# Altium schematic sheet LVDT Driver.SchDoc
size A3
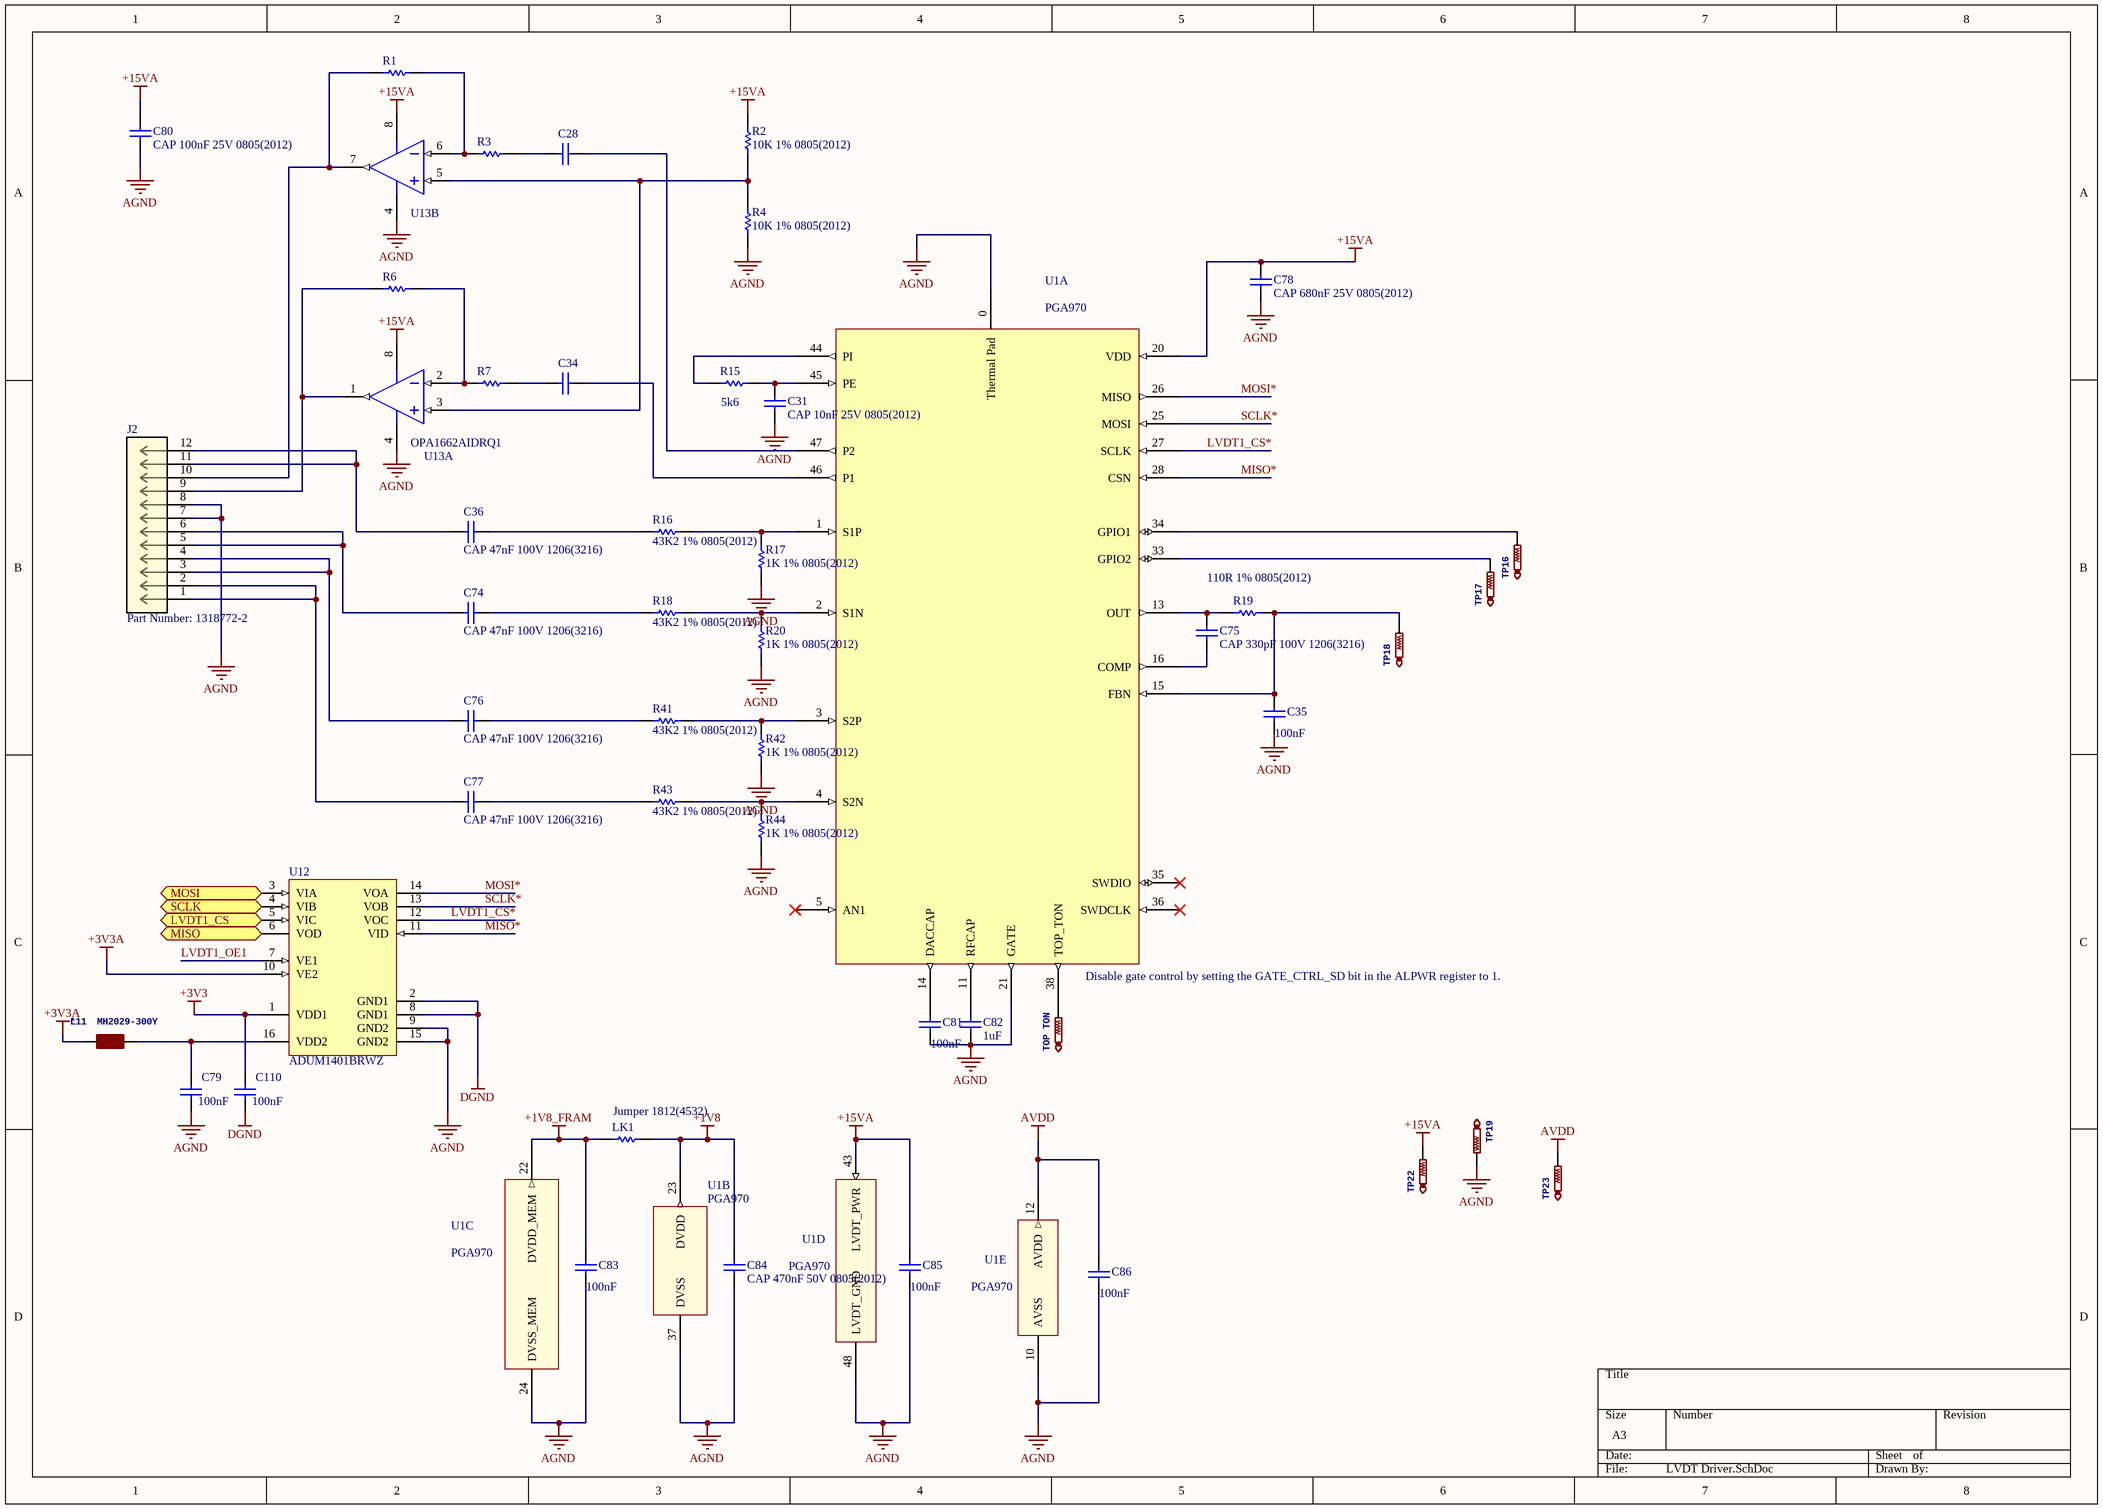
[diagram p0: LVDT Driver.SchDoc]

## Parts
C28  C1206C474K5RACTU  [CAPC3216X100X50LL20T25]  (value not drawn)
C31  CAP 10nF 25V 0805(2012)  [CAPC0805(2012)75_L]
C34  C1206C474K5RACTU  [CAPC3216X100X50LL20T25]  (value not drawn)
C35  100nF  [CAPC0805(2012)75_N]
C36  CAP 47nF 100V 1206(3216)  [CAPC1206(3216)100_L]
C74  CAP 47nF 100V 1206(3216)  [CAPC1206(3216)100_L]
C75  CAP 330pF 100V 1206(3216)  [CAPC1206(3216)170_L]
C76  CAP 47nF 100V 1206(3216)  [CAPC1206(3216)100_L]
C77  CAP 47nF 100V 1206(3216)  [CAPC1206(3216)100_L]
C78  CAP 680nF 25V 0805(2012)  [CAPC0805(2012)100_N]
C79  value 100nF  [CAPC0603(1608)100_N]  (hidden comment: CAP 100nF 25V 0603(1608))
C80  CAP 100nF 25V 0805(2012)  [CAPC0805(2012)75_N]
C81  100nF  [CAPC0805(2012)75_N]
C82  value 1uF  [CAPC2220(5750)230_L]  (hidden comment: CAP 4.7uF 50V 2220(5750))
C83  100nF  [CAPC0805(2012)75_N]
C84  CAP 470nF 50V 0805(2012)  [CAPC0805(2012)145_M]
C85  100nF  [CAPC0805(2012)75_N]
C86  100nF  [CAPC0805(2012)75_N]
C110  value 100nF  [CAPC0603(1608)100_N]  (hidden comment: CAP 100nF 25V 0603(1608))
J2  Part Number: 1318772-2  [CONN12_1318772]
L11  MH2029-300Y  [0805]
LK1  Jumper 1812(4532)  [RESC1812(4532)_M]
R1  510K 1% 0805(2012)  [RESC0805(2012)_L]  (value not drawn)
R2  10K 1% 0805(2012)  [RESC0805(2012)_M]
R3  31K6 1% 0805(2012)  [RESC0805(2012)_N]  (value not drawn)
R4  10K 1% 0805(2012)  [RESC0805(2012)_M]
R6  510K 1% 0805(2012)  [RESC0805(2012)_L]  (value not drawn)
R7  31K6 1% 0805(2012)  [RESC0805(2012)_N]  (value not drawn)
R15  value 5k6  [RESC0805(2012)_L]  (hidden comment: 5K6 1% 0805(2012))
R16  43K2 1% 0805(2012)  [RESC0805(2012)_L]
R17  1K 1% 0805(2012)  [RESC0805(2012)_M]
R18  43K2 1% 0805(2012)  [RESC0805(2012)_L]
R19  110R 1% 0805(2012)  [RESC0805(2012)_L]
R20  1K 1% 0805(2012)  [RESC0805(2012)_M]
R41  43K2 1% 0805(2012)  [RESC0805(2012)_L]
R42  1K 1% 0805(2012)  [RESC0805(2012)_M]
R43  43K2 1% 0805(2012)  [RESC0805(2012)_L]
R44  1K 1% 0805(2012)  [RESC0805(2012)_M]
TOP_TON  PTR1PAD1-13  [P1-13]  (value not drawn)
TP16  PTR1PAD1-13  [P1-13]  (value not drawn)
TP17  PTR1PAD1-13  [P1-13]  (value not drawn)
TP18  PTR1PAD1-13  [P1-13]  (value not drawn)
TP19  PTR1PAD1-13  [P1-13]  (value not drawn)
TP22  PTR1PAD1-13  [P1-13]  (value not drawn)
TP23  PTR1PAD1-13  [P1-13]  (value not drawn)
U1  PGA970  [PHP0048A_L]  (parts A,B,C,D,E of 6)
U12  ADUM1401BRWZ  [ADI-RW-16_M]
U13  OPA1662AIDRQ1  [D0008A_L]  (parts A,B of 2)

## Ports
LVDT1_CS (in), MISO (out), MOSI (in), SCLK (in)

## Nets
+1V8: C84.2 LK1.2 U1.23(DVDD)
+1V8_FRAM: C83.2 LK1.1 U1.22(DVDD_MEM)
+3V3: C110.1 U12.1(VDD1)
+3V3A: L11.1 U12.10(VE2)
+15VA: C78.2 C80.2 C85.2 R2.2 TP22.TP U1.20(VDD) U1.43(LVDT_PWR) U13.8(V+)
AGND: C31.1 C35.1 C78.1 C79.2 C80.1 C81.1 C82.1 C83.1 C84.1 C85.1 C86.1 J2.7 J2.8 R4.1 R17.1 R20.1 R42.1 R44.1 TP19.TP U1.0(Thermal_Pad) U1.10(AVSS) U1.21(GATE) U1.24(DVSS_MEM) U1.37(DVSS) U1.48(LVDT_GND) U12.9(GND2) U12.15(GND2) U13.4(V-)
AVDD: C86.2 TP23.TP U1.12(AVDD)
DGND: C110.2 U12.2(GND1) U12.8(GND1)
LVDT1_CS: U12.5(VIC) ; port LVDT1_CS
LVDT1_CS*: U1.27(SCLK) U12.12(VOC)
LVDT1_OE1: U12.7(VE1)
MISO: U12.6(VOD) ; port MISO
MISO*: U1.28(CSN) U12.11(VID)
MOSI: U12.3(VIA) ; port MOSI
MOSI*: U1.26(MISO) U12.14(VOA)
SCLK: U12.4(VIB) ; port SCLK
SCLK*: U1.25(MOSI) U12.13(VOB)
NetC28_1: C28.1 R3.2
NetC28_2: C28.2 U1.47(P2)
NetC31_2: C31.2 R15.2 U1.45(PE)
NetC34_1: C34.1 R7.2
NetC34_2: C34.2 U1.46(P1)
NetC35_2: C35.2 R19.2 TP18.TP U1.15(FBN)
NetC36_1: C36.1 J2.11 J2.12
NetC36_2: C36.2 R16.1
NetC74_1: C74.1 J2.5 J2.6
NetC74_2: C74.2 R18.1
NetC75_1: C75.1 U1.16(COMP)
NetC75_2: C75.2 R19.1 U1.13(OUT)
NetC76_1: C76.1 J2.3 J2.4
NetC76_2: C76.2 R41.1
NetC77_1: C77.1 J2.1 J2.2
NetC77_2: C77.2 R43.1
NetC79_1: C79.1 L11.2 U12.16(VDD2)
NetC81_2: C81.2 U1.14(DACCAP)
NetC82_2: C82.2 U1.11(RFCAP)
NetJ2_9: J2.9 R6.1 U13.1(OUT_A)
NetJ2_10: J2.10 R1.1 U13.7(OUT_B)
NetR1_2: R1.2 R3.1 U13.6(IN_B-)
NetR2_1: R2.1 R4.2 U13.3(IN_A+) U13.5(IN_B+)
NetR6_2: R6.2 R7.1 U13.2(IN_A-)
NetR15_1: R15.1 U1.44(PI)
NetR16_2: R16.2 R17.2 U1.1(S1P)
NetR18_2: R18.2 R20.2 U1.2(S1N)
NetR41_2: R41.2 R42.2 U1.3(S2P)
NetR43_2: R43.2 R44.2 U1.4(S2N)
NetTOP_TON_TP: TOP_TON.TP U1.38(TOP_TON)
NetTP16_TP: TP16.TP U1.34(GPIO1)
NetTP17_TP: TP17.TP U1.33(GPIO2)

Not connected (* = marked no-connect by the designer): U1 5(AN1)* 35(SWDIO)* 36(SWDCLK)*

## Notes on the sheet
- (near U1) Disable gate control by setting the GATE_CTRL_SD bit in the ALPWR register to 1.

## Library data of the parts
C28 C34 = CMP-2000-06016-1: Chip Capacitor, 470 nF, +/- 10%, 50 V, -55 to 125 degC, 1206 (3216 Metric), RoHS, Tape and Reel; Manufacturer: Kemet; Case Length: 3.2mm; Class: 2; Case Height: 0.9mm; Capacitance - pF: 470000pF; Capacitance - nF: 470nF; Capacitance: 0.47uF; Dielectric: X7R; Voltage Rating DC: 50V; Case Width: 1.6mm; Temperature Coefficient / Code: +/-15%; Type: SMDMLCCsX7R,Commercial; Manufacturer URL: http://www.kemet.com/; Maximum Operating Temperature: +125C; Minimum Operating Temperature: -55C; Brand: Kemet; Case Code - in: 1206; Datasheet Version: 02/2016; Case Code - mm: 3216; Series: C1206C; Mounting Technology: SurfaceMount; Package Reference: 1206; Termination Style: SMD/SMT; Tolerance: 10%; Datasheet URL: http://www.kemet.com/docfinder?Partnumber=C1206C106K8RACTU; Dimensions: 1.6mmWx3.2mmLx0.9mmH; Packaging: Reel; Factory Pack Quantity: 4000; Product Category: MultilayerCeramicCapacitorsMLCC-SMD/SMT; RoHS: Details; Operating Temperature Range: -55Cto+125C; Product: GeneralTypeMLCCs; Package Description: 2-Pin Surface Mount Device, Body 3.2 x 1.6 mm; Package / Case: 1206(3216metric); Voltage Rating: 50V
C31 = CMP-1036-03827-1: CAP 10nF 25V ±5% 0805 (2012 Metric) Thickness 0.75mm SMD; Case-EIA: 0805; Tolerance: Â±5%; Case-Metric: 2012; Rated Voltage: 25 V; Value: 10nF; Technology: SMT; Max Thickness: 0.75 mm
C35 C80 C81 C83 C85 C86 = CMP-1036-04415-1: CAP 100nF 25V -20% to +80% 0805 (2012 Metric) Thickness 0.75mm SMD; Case-EIA: 0805; Case-Metric: 2012; Rated Voltage: 25 V; Value: 100nF; Tolerance: -20% to +80%; Technology: SMT; Max Thickness: 0.75 mm
C36 C74 C76 C77 = CMP-1037-04001-1: CAP 47nF 100V ±20% 1206 (3216 Metric) Thickness 1mm SMD; Tolerance: Â±20%; Case-Metric: 3216; Case-EIA: 1206; Value: 47nF; Rated Voltage: 100 V; Max Thickness: 1 mm; Technology: SMT
C75 = CMP-1037-02011-1: CAP 330pF 100V ±1% 1206 (3216 Metric) Thickness 1.7mm SMD; Tolerance: Â±1%; Case-Metric: 3216; Case-EIA: 1206; Rated Voltage: 100 V; Max Thickness: 1.7 mm; Value: 330pF; Technology: SMT
C78 = CMP-1036-04706-1: CAP 680nF 25V ±10% 0805 (2012 Metric) Thickness 1mm SMD; Case-EIA: 0805; Tolerance: Â±10%; Case-Metric: 2012; Rated Voltage: 25 V; Value: 680nF; Technology: SMT; Max Thickness: 1 mm
C79 C110 = CMP-1035-02587-1: CAP 100nF 25V ±5% 0603 (1608 Metric) Thickness 1mm SMD; Case-EIA: 0603; Tolerance: Â±5%; Case-Metric: 1608; Technology: SMT; Max Thickness: 1 mm; Rated Voltage: 25 V
C82 = CMP-1042-00755-1: CAP 4.7uF 50V ±10% 2220 (5750 Metric) Thickness 2.2mm SMD; Case-Metric: 5750; Tolerance: Â±10%; Case-EIA: 2220; Rated Voltage: 50 V; Max Thickness: 2.2 mm; Technology: SMT
C84 = CMP-1036-04654-1: CAP 470nF 50V ±10% 0805 (2012 Metric) Thickness 1.45mm SMD; Case-EIA: 0805; Tolerance: Â±10%; Case-Metric: 2012; Rated Voltage: 50 V; Value: 470nF; Technology: SMT; Max Thickness: 1.45 mm
J2 = 1318772-2: 025 CAP HSG ASSY 12P; Vendor: TE Connectivity; ROWS/CONFIG: 2; PITCH(MM): 0.087; POSITIONS: 12; Built_By: EMA_UL_Team; Copyright: Copyright (C) 2016 Accelerated Designs. All rights reserved; Manufacturer_Part_Number: 1318772-2; TE_Part_Number: 1318772-2; PRODUCT: -; Type: DEV; RefDes: RefDes; Value: Value
L11 = WE-CBF_0805: SMD EMI Suppression Ferrite Beads - excellent anti-EMI properties - low DCR - impedances till 3000 ohms - rated current up to 6 A; NAME: *
LK1 = CMP-1016-00001-1: Jumper 1812 (4532 Metric); Tolerance: None; Case-EIA: 1812; Value: 0.00 Ohm; Case-Metric: 4532; Technology: SMT; Power: None
R1 R6 = CMP-1013-00816-1: 510K 0.125W 1% 0805 (2012 Metric)  SMD; Case-Metric: 2012; Value: 510000.00 Ohm; Case-EIA: 0805; Power: 0.125 W; Technology: SMT; Tolerance: 1 %
R2 R4 = CMP-1013-00623-1: 10K 0.125W 1% 0805 (2012 Metric)  SMD; Value: 10000.00 Ohm; Case-Metric: 2012; Case-EIA: 0805; Tolerance: 1 %; Power: 0.125 W; Technology: SMT
R3 R7 = CMP-1013-00678-1: 31K6 0.125W 1% 0805 (2012 Metric)  SMD; Case-EIA: 0805; Case-Metric: 2012; Value: 31600.00 Ohm; Tolerance: 1 %; Technology: SMT; Power: 0.125 W
R15 = CMP-1013-00595-1: 5K6 0.125W 1% 0805 (2012 Metric)  SMD; Case-EIA: 0805; Case-Metric: 2012; Technology: SMT; Power: 0.125 W; Tolerance: 1 %
R16 R18 R41 R43 = CMP-1013-00695-1: 43K2 0.125W 1% 0805 (2012 Metric)  SMD; Case-EIA: 0805; Case-Metric: 2012; Value: 43200.00 Ohm; Technology: SMT; Power: 0.125 W; Tolerance: 1 %
R17 R20 R42 R44 = CMP-1013-00510-1: 1K 0.125W 1% 0805 (2012 Metric)  SMD; Case-Metric: 2012; Value: 1000.00 Ohm; Case-EIA: 0805; Tolerance: 1 %; Power: 0.125 W; Technology: SMT
R19 = CMP-1013-00401-1: 110R 0.125W 1% 0805 (2012 Metric)  SMD; Value: 110.00 Ohm; Case-Metric: 2012; Case-EIA: 0805; Technology: SMT; Tolerance: 1 %; Power: 0.125 W
TOP_TON TP16-TP19 TP22 TP23 = PTR1PAD1-13: TEST PIN
U12 = CMP-0534-00565-1: Quad Channel Digital Isolator, 2.5 KV rms Insulation Rating, 10 Mbps Data Rate, 50 ns Delay, Industrial, 16-pin SOIC (RW-16), Tube; Manufacturer: Analog Devices; Max Data Rate: 10Mbps; ComponentLink2URL: http://www.analog.com/static/imported-files/data_sheets/ADuM1400_1401_1402.pdf; ComponentLink5Description: URL Link2; ComponentLink3URL: http://www.analog.com/static/imported-files/packages/PKG_PDF/SOIC_WIDE%20%28RW%29/RW_16.pdf; DatasheetVersion: Rev. H; ComponentLink2Description: Datasheet; ComponentLink3Description: Package Specification; PartNumber: ADUM1401BRWZ; ComponentLink5URL: Reference Circuit:http://www.analog.com/en/interface-isolation/digital-isolators/adum1401/products/product.html#product-recommendations; Max Operating Temp (degreesC): 125; PackageReference: RW-16; PackageVersion: 032707-B, 03/2007; ComponentLink1Description: Manufacturer URL; Code_JEDEC: MS-013-AA; PackageDescription: 16-Pin Standard Small Outline Package, Body 10.3 x 7.5 mm, Pitch 1.27 mm; Mounting Technology: Surface Mount; ComponentLink1URL: http://www.analog.com/en/index.html; ComponentLink4Description: URL Link1; ComponentLink4URL: Product URL:http://www.analog.com/en/interface-isolation/digital-isolators/adum1401/products/product.html
U13 = CMP-0271-00139-3: Automotive Catalog, Sound Plus, Low-Power, Low-Noise and Distortion, Audio Operational Amplifier, 3 to 36 V, -40 to 85 degC, 8-pin SOIC (D8), Green (RoHS & no Sb/Br); Manufacturer: Texas Instruments; GBW(Typ)(MHz): 22; Packing: LARGE T&R; Number of Channels: 2; Sub Family: High Supply Voltage Amplifier (>=30V), Low Noise Amp (<=10nV/rtHz), Precision Amplifier; Slew Rate(Typ)(V/us): 17; IIB(Max)(pA): 1200000; Vio (25C)(Max)(mV): 1.5; Total Supply Voltage(Min)(+5V is 5, +/-5V is 10): 3; Total Supply Voltage(Max)(+5V is 5, +/-5V is 10): 36; CMRR(Min)(dB): 106; Iq per channel(Max)(mA): 1.8; ComponentLink3URL: http://www.ti.com/litv/pdf/msoi002j; Rating: Automotive; Eco-Plan: Green (RoHS & no Sb/Br); PackageDescription: 8-Pin Plastic Small Outline, Body 4.9 x 3.9 mm, Pitch 1.27 mm; Mounting Technology: Surface Mount; ComponentLink1Description: Manufacturer URL; ComponentLink2Description: Datasheet; PackageReference: D0008A; ComponentLink2URL: http://www.ti.com/lit/ds/symlink/opa1662-q1.pdf; PackageVersion: 4040047-3/M, 06/2011; ComponentLink1URL: http://www.ti.com/; DatasheetVersion: SLOS805B; Code_JEDEC: MS-012; ComponentLink3Description: Package Specification; PartNumber: OPA1662AIDRQ1; Offset Drift(Typ)(uV/C): 2; PartId: 1